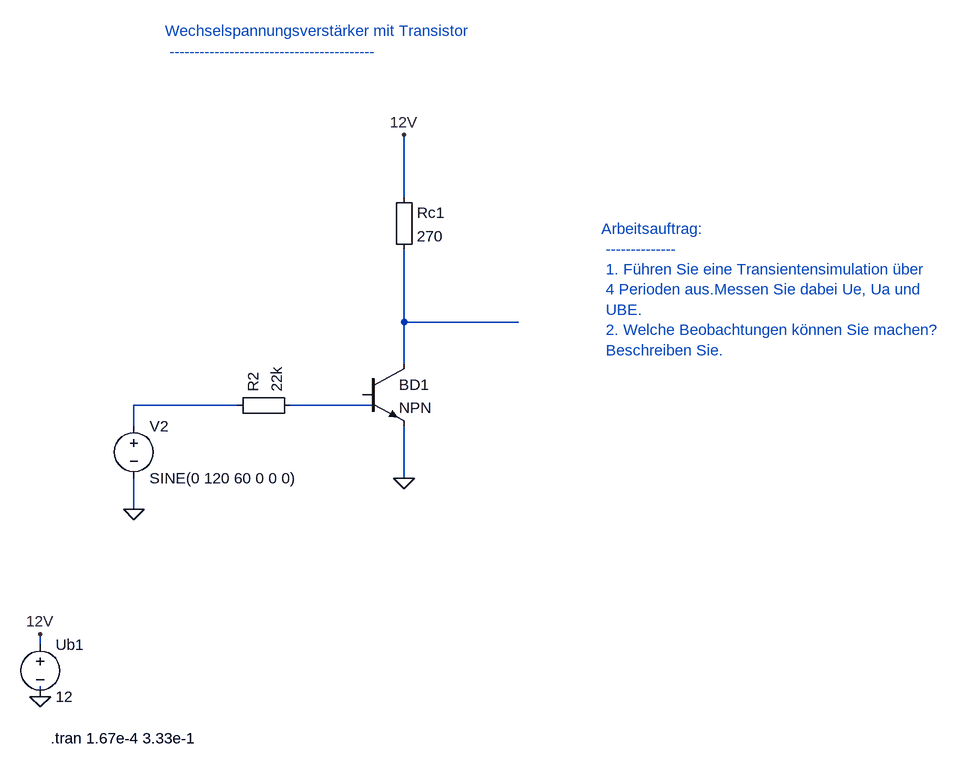
[diagram p0: schematic 9_1_1_Wechselspannungsverstaerker_mit_Transistor.asc]
9_1_1_Wechselspannungsverstaerker_mit_Transistor.asc, the LTspice schematic file:
Version 4
SHEET 1 880 680
WIRE 48 1072 48 1056
WIRE 544 608 560 608
WIRE 560 608 560 624
WIRE 608 656 608 688
WIRE 192 736 192 752
WIRE 48 992 48 976
WIRE 560 624 432 624
WIRE 608 688 608 736
WIRE 192 656 192 624
WIRE 192 624 352 624
WIRE 192 784 192 752
WIRE 608 304 608 208
WIRE 608 384 608 496
WIRE 608 496 608 560
WIRE 784 496 608 496
FLAG 608 736 0
FLAG 48 1072 0
FLAG 192 784 0
FLAG 608 736 0
FLAG 48 1072 0
FLAG 192 784 0
FLAG 48 976 12V
FLAG 608 208 12V
SYMBOL voltage 48 976 R0
SYMATTR InstName Ub1
SYMATTR Value 12
SYMBOL npn 544 560 R0
SYMATTR InstName BD1
SYMATTR Value NPN
SYMBOL Misc\EuropeanResistor 336 640 R270
SYMATTR InstName R2
SYMATTR Value 22k
SYMBOL voltage 192 640 R0
SYMATTR InstName V2
SYMATTR Value SINE(0 120 60 0 0 0)
SYMBOL Misc\EuropeanResistor 592 288 R0
SYMATTR InstName Rc1
SYMATTR Value 270
TEXT 64 1136 Left 2 !.tran 1.67e-4 3.33e-1
TEXT 240 48 Left 2 ;Wechselspannungsverstärker mit Transistor \n -----------------------------------------
TEXT 912 352 Left 2 ;Arbeitsauftrag: \n -------------- \n 1. Führen Sie eine Transientensimulation über \n 4 Perioden aus.Messen Sie dabei Ue, Ua und \n UBE. \n 2. Welche Beobachtungen können Sie machen? \n Beschreiben Sie.

The netlist it stands for:
* 9_1_1_Wechselspannungsverstaerker_mit_Transistor.asc
V§Ub1 12V 0 12
Q§BD1 N003 N001 0 0 NPN
R2 N002 N001 22k
V2 N002 0 SINE(0 120 60 0 0 0)
Rc1 12V N003 270
.model NPN NPN
.model PNP PNP
.lib standard.bjt
.tran 1.67e-4 3.33e-1
* Wechselspannungsverstärker mit Transistor
*  -----------------------------------------
* Arbeitsauftrag:
*  --------------
*  1. Führen Sie eine Transientensimulation über
*  4 Perioden aus.Messen Sie dabei Ue, Ua und
*  UBE.
*  2. Welche Beobachtungen können Sie machen?
*  Beschreiben Sie.
.backanno
.end